# EAGLE design USB Miner (EAGLE 9.6.2)
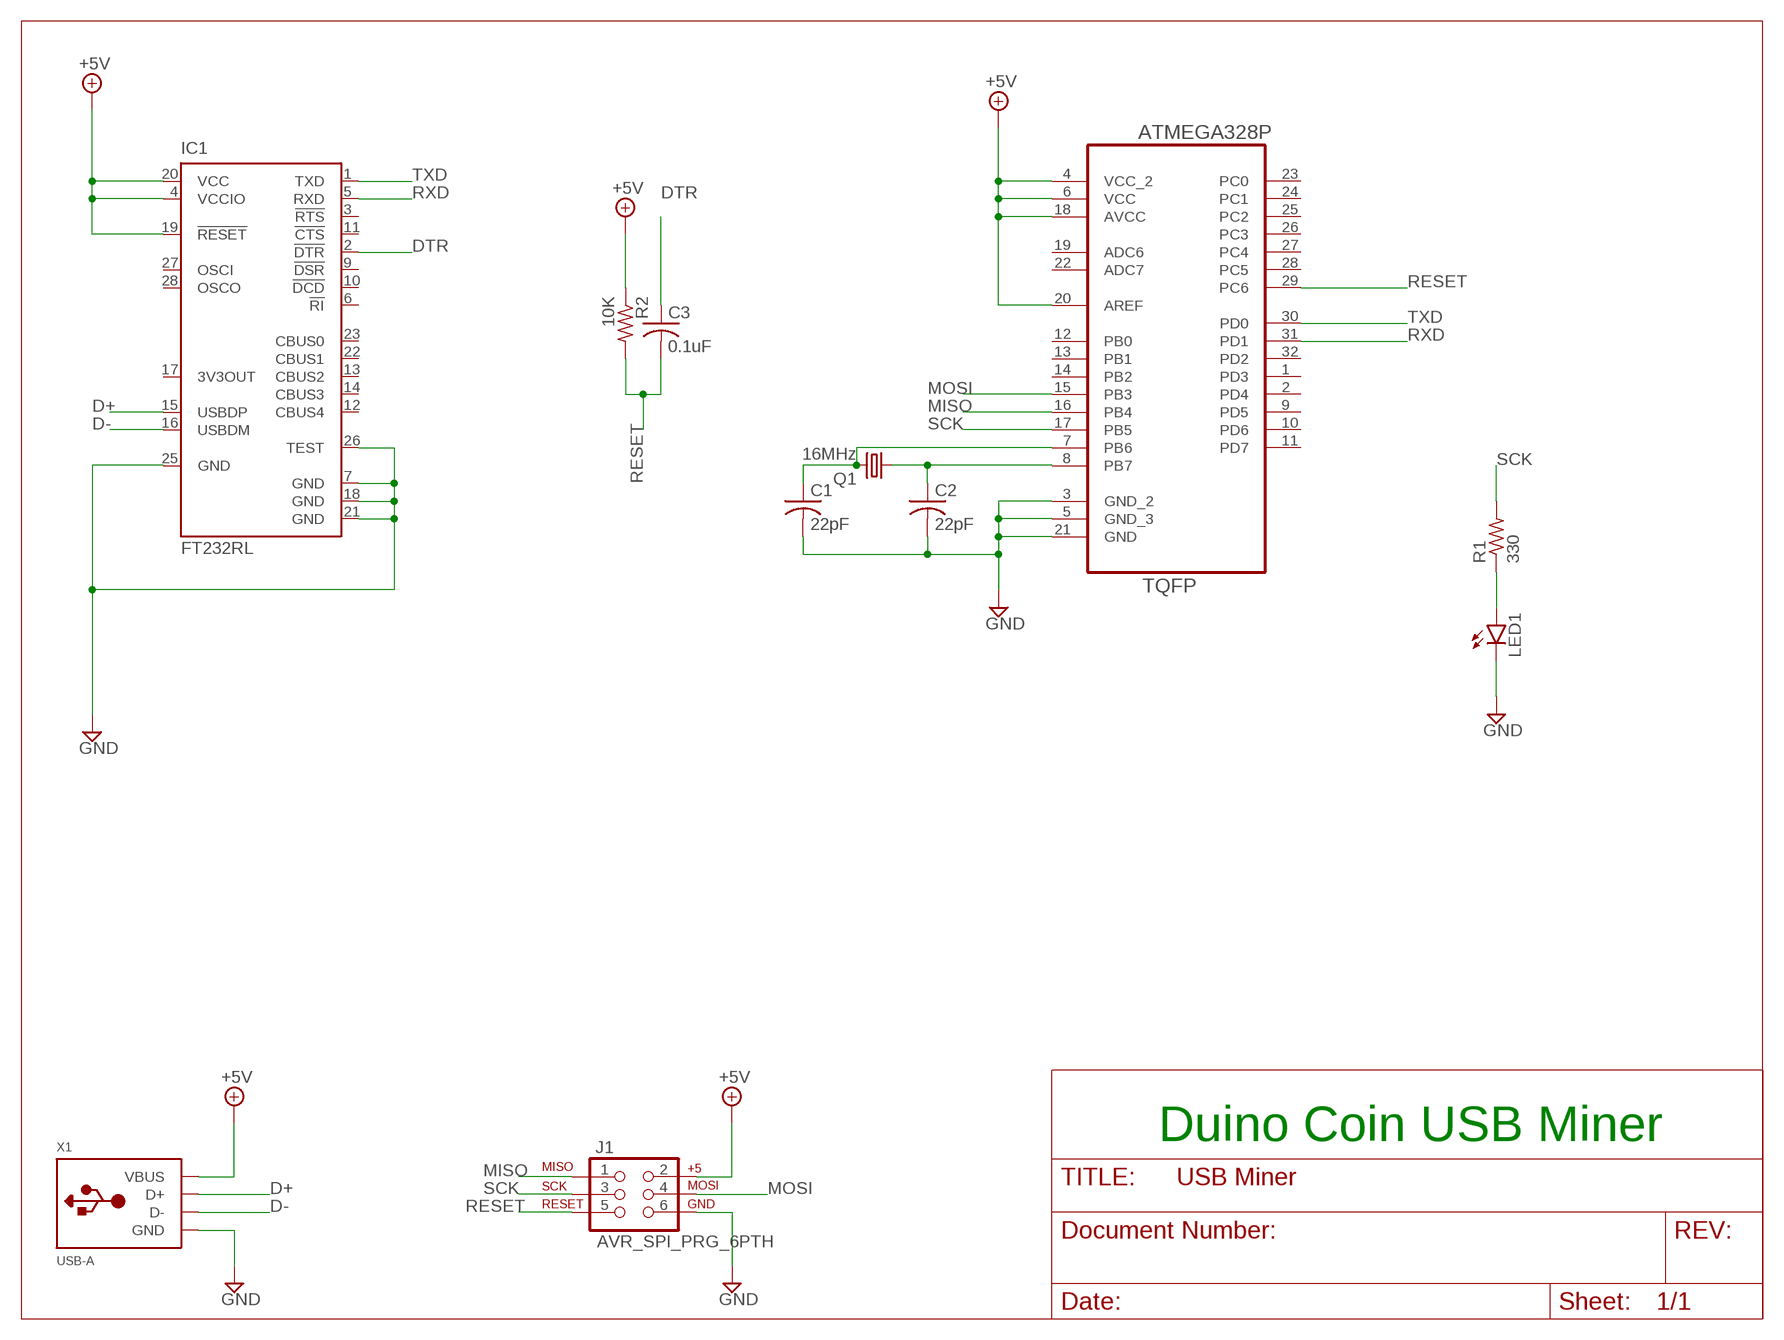
[diagram p0: schematic, sheet 1]

## Parts
C1  22pF  C-USC0805  [C0805]
C2  22pF  C-USC0805  [C0805]
C3  0.1uF  C-USC0805  [C0805]
IC1  FT232RL  [SSOP28]
J1  AVR_SPI_PRG_6PTH  [2X3]
LED1  LEDCHIP-LED0805  [CHIP-LED0805]
Q1  16MHz  CRYSTALCTS406  [CTS406]
R1  330  R-US_M0805  [M0805]
R2  10K  R-US_M0805  [M0805]
U1  ATMEGA328P-AU  [QFP80P900X900X120-32N]
X1  USB-A  [MOLEX_480371000]

## Nets
+5V: IC1.4(VCCIO) IC1.19(!RESET) IC1.20(VCC) J1.2 R2.1 U1.4(VCC_2) U1.6(VCC) U1.18(AVCC) U1.20(AREF) X1.1(VBUS)
D+: IC1.15(USBDP) X1.3(D+)
D-: IC1.16(USBDM) X1.2(D-)
DTR: C3.1 IC1.2(!DTR)
GND: C1.2 C2.2 IC1.7(GND) IC1.18(GND) IC1.21(GND) IC1.25(GND) IC1.26(TEST) J1.6 LED1.C U1.3(GND_2) U1.5(GND_3) U1.21(GND) X1.4(GND)
MISO: J1.1 U1.16(PB4)
MOSI: J1.4 U1.15(PB3)
N$1: C2.1 Q1.1 U1.8(PB7)
N$2: C1.1 Q1.3 U1.7(PB6)
N$3: LED1.A R1.1
RESET: C3.2 J1.5 R2.2 U1.29(PC6)
RXD: IC1.5(RXD) U1.31(PD1)
SCK: J1.3 R1.2 U1.17(PB5)
TXD: IC1.1(TXD) U1.30(PD0)
Unconnected: IC1.3(!RTS) IC1.6(!RI) IC1.9(!DSR) IC1.10(!DCD) IC1.11(!CTS) IC1.12(CBUS4) IC1.13(CBUS2) IC1.14(CBUS3) IC1.17(3V3OUT) IC1.22(CBUS1) IC1.23(CBUS0) IC1.27(OSCI) IC1.28(OSCO) U1.1(PD3) U1.2(PD4) U1.9(PD5) U1.10(PD6) U1.11(PD7) U1.12(PB0) U1.13(PB1) U1.14(PB2) U1.19(ADC6) U1.22(ADC7) U1.23(PC0) U1.24(PC1) U1.25(PC2) U1.26(PC3) U1.27(PC4) U1.28(PC5) U1.32(PD2)

## Notes on the sheet
- Duino Coin USB Miner

## Library data of the parts
C1-C3 = rcl:C-US: CAPACITOR, American symbol; SPICEPREFIX: C
IC1 = ftdichip:FT232R: Source: http://www.ftdichip.com/Documents/DataSheets/DS_FT232R_v104.pdf; MPN: FT232RL; OC_FARNELL: 1146032; OC_NEWARK: 91K9918
J1 = SparkFun:AVR_SPI_PRG_6: AVR ISP 6 Pin This is the reduced ISP connector for AVR programming. Common on Arduino. This footprint will take up less PCB space and can be used with a 10-pin to 6-pin adapter such as SKU: BOB-08508
LED1 = led:LED: LED OSRAM: - CHIPLED LG R971, LG N971, LY N971, LG Q971, LY Q971, LO R971, LY R971 LH N974, LH R974 LS Q976, LO Q976, LY Q976 LO Q996 - Hyper CHIPLED LW Q18S LB Q993, LB Q99A, LB R99A - SideLED LS A670, LO A670, LY A670, LG A670, LP A670 LB A673, LV A673, LT A673, LW A673 LH A674 LY A675 LS A676, LA A676, LO A676, LY A676, LW A676 LS A679, LY A679, LG A679 - Hyper Micro SIDELED® LS Y876, LA Y876, LO Y876, LY Y876 LT Y87S - SmartLED LW L88C, LW L88S LB L89C, LB L89S, LG L890 LS L89K, LO L89K, LY L89K LS L896, LA L896, LO L896, LY L896 - TOPLED LS T670, LO T670, LY T670, LG T670, LP T670 LSG T670, LSP T670, LSY T670, LOP T670, LYG T670 LG T671, LOG T671, LSG T671 LB T673, LV T673, LT T673, LW T673 LH T674 LS T676, LA T676, LO T676, LY T676, LB T676, LH T676, LSB T676, LW T676 LB T67C, LV T67C, LT T67C, LS T67K, LO T67K, LY T67K, LW E67C LS E67B, LA E67B, LO E67B, LY E67B, LB E67C, LV E67C, LT E67C LW T67C LS T679, LY T679, LG T679 LS T770, LO T770, LY T770, LG T770, LP T770 LB T773, LV T773, LT T773, LW T773 LH T774 LS E675, LA E675, LY E675, LS T675 LS T776, LA T776, LO T776, LY T776, LB T776 LHGB T686 LT T68C, LB T68C - Hyper Mini TOPLED® LB M676 - Mini TOPLED Santana® LG M470 LS M47K, LO M47K, LY M47K Source: http://www.osram.convergy.de LUXEON: - LUMILED® LXK2-PW12-R00, LXK2-PW12-S00, LXK2-PW14-U00, LXK2-PW14-V00 LXK2-PM12-R00, LXK2-PM12-S00, LXK2-PM14-U00 LXK2-PE12-Q00, LXK2-PE12-R00, LXK2-PE12-S00, LXK2-PE14-T00, LXK2-PE14-U00 LXK2-PB12-K00, LXK2-PB12-L00, LXK2-PB12-M00, LXK2-PB14-N00, LXK2-PB14-P00, LXK2-PB14-Q00 LXK2-PR12-L00, LXK2-PR12-M00, LXK2-PR14-Q00, LXK2-PR14-R00 LXK2-PD12-Q00, LXK2-PD12-R00, LXK2-PD12-S00 LXK2-PH12-R00, LXK2-PH12-S00 LXK2-PL12-P00, LXK2-PL12-Q00, LXK2-PL12-R00 Source: www.luxeon.com KINGBRIGHT: KA-3528ASYC Source: www.kingbright.com
Q1 = crystal:CRYSTAL: CRYSTAL; OC_FARNELL: unknown; OC_NEWARK: unknown
R1 R2 = rcl:R-US_: RESISTOR, American symbol; SPICEPREFIX: R
U1 = Ava:ATMEGA328P-AU; DESCRIPTION: 8-bit Microcontroller with In-System Programmable Flash; MPN: ATMEGA328P-AU; OC_FARNELL: 1715486; OC_NEWARK: 14R4631; PACKAGE: TQFP-32; SUPPLIER: Atmel
X1 = adafruit:USB-A: USB type A 'plug' Used for things that can directly connect to a USB port, say USB key

## Board
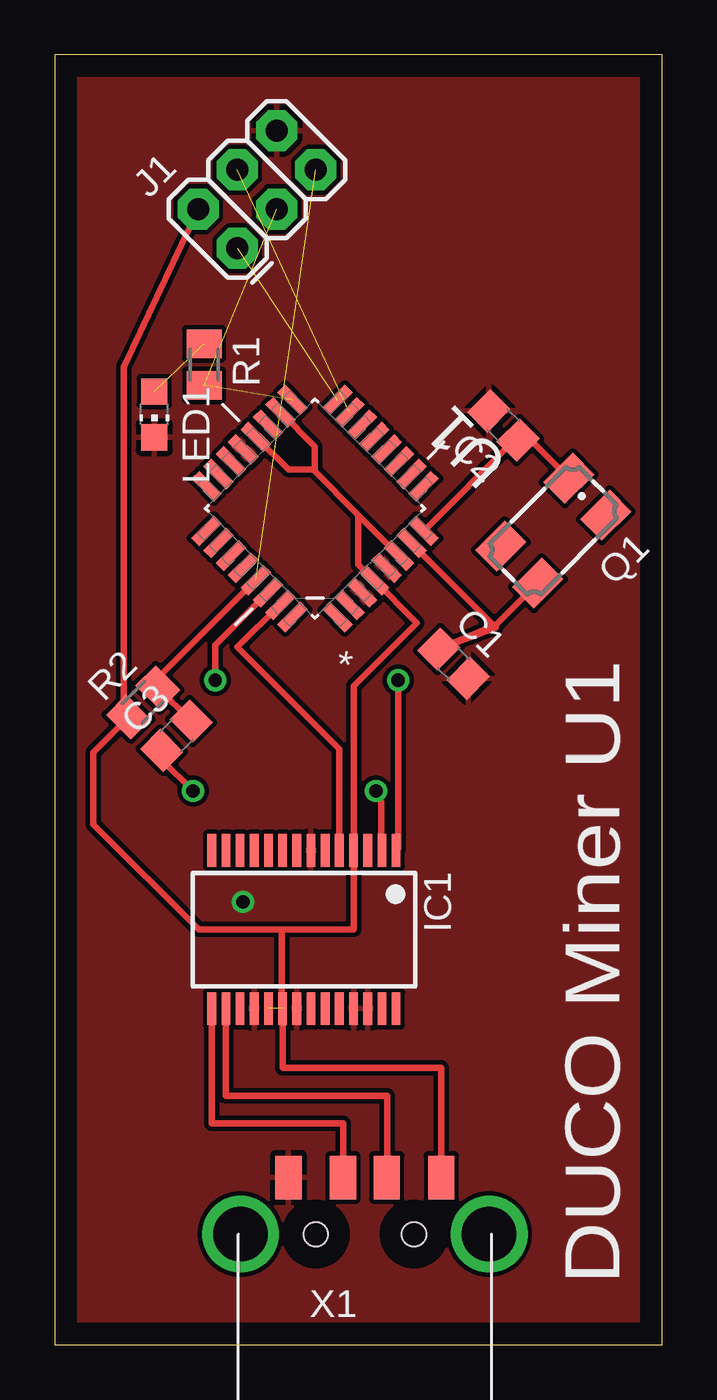
[diagram p1: board, top side]
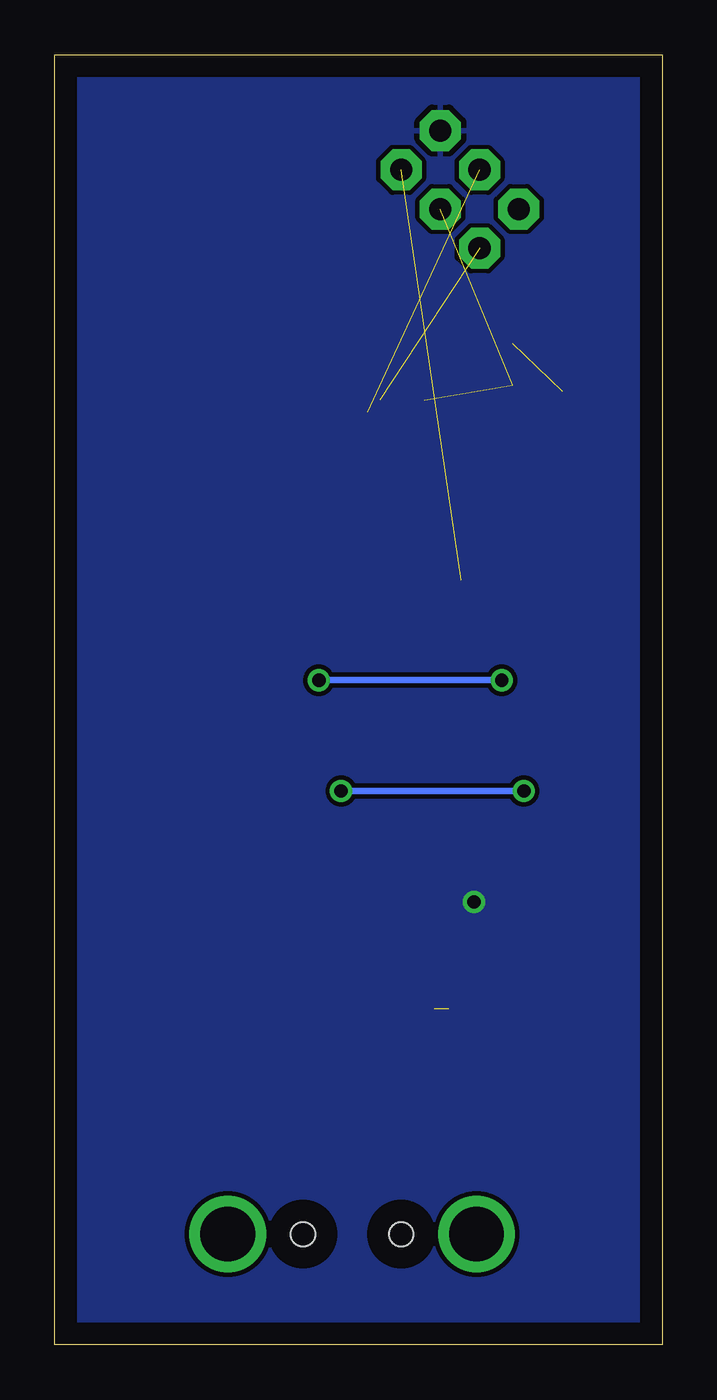
[diagram p2: board, bottom side, seen from below]

Size 27.86 x 59.17 mm. Coordinates in mm from the lower left corner, seen from the top.
Outline: 0,0 27.86,0 27.86,59.17 0,59.17 0,0
Copper layers (1*16): Top 0.035mm / dielectric 1.5mm / Bottom 0.035mm
Design rules "default": minimum track width 10mil, minimum drill 24mil, track to track 8mil, track to pad 8mil, pad to pad 8mil, via to via 8mil, smd to smd 8mil, copper to edge 40mil, drill to drill 8mil, minimum pad ring 10mil, minimum via ring 8mil, stop-mask expansion 4mil, vias tented up to drill 0mil, thermal gap 10mil

### Footprints (pad centres in the part's own frame; a part is rotated, then mirrored left to right if it is on the bottom)
C0805 = smd 1.3 x 1.5: 1 -0.95,0; 2 0.95,0
SSOP28 = smd 0.4 x 1.5: 1 -4.225,-3.625; 2 -3.575,-3.625; 3 -2.925,-3.625; 4 -2.275,-3.625; 5 -1.625,-3.625; 6 -0.975,-3.625; 7 -0.325,-3.625; 8 0.325,-3.625; 9 0.975,-3.625; 10 1.625,-3.625; 11 2.275,-3.625; 12 2.925,-3.625; 13 3.575,-3.625; 14 4.225,-3.625; 15 4.225,3.625; 16 3.575,3.625; 17 2.925,3.625; 18 2.275,3.625; 19 1.625,3.625; 20 0.975,3.625; 21 0.325,3.625; 22 -0.325,3.625; 23 -0.975,3.625; 24 -1.625,3.625; 25 -2.275,3.625; 26 -2.925,3.625; 27 -3.575,3.625; 28 -4.225,3.625
2X3 = drill 1.016 pad 1.88 octagon: 1 0,0; 2 0,2.54; 3 2.54,0; 4 2.54,2.54; 5 5.08,0; 6 5.08,2.54
CHIP-LED0805 = smd 1.2 x 1.2: A 0,-1.05; C 0,1.05
CTS406 = smd 1.9 x 1.4: 1 -2.2,-1.2; 2 2.2,-1.2; 3 2.2,1.2; 4 -2.2,1.2
M0805 = smd 1.3 x 1.6: 1 -0.95,0; 2 0.95,0
QFP80P900X900X120-32N = smd 1.473 x 0.508: 1 -4.242,2.794; 2 -4.242,2.007; 3 -4.242,1.194; 4 -4.242,0.406; 5 -4.242,-0.406; 6 -4.242,-1.194; 7 -4.242,-2.007; 8 -4.242,-2.794; 17 4.242,-2.794; 18 4.242,-2.007; 19 4.242,-1.194; 20 4.242,-0.406; 21 4.242,0.406; 22 4.242,1.194; 23 4.242,2.007; 24 4.242,2.794 | smd 0.508 x 1.473: 9 -2.794,-4.242; 10 -2.007,-4.242; 11 -1.194,-4.242; 12 -0.406,-4.242; 13 0.406,-4.242; 14 1.194,-4.242; 15 2.007,-4.242; 16 2.794,-4.242; 25 2.794,4.242; 26 2.007,4.242; 27 1.194,4.242; 28 0.406,4.242; 29 -0.406,4.242; 30 -1.194,4.242; 31 -2.007,4.242; 32 -2.794,4.242
MOLEX_480371000 = smd 1.2 x 2: 1 3.5,2.6; 2 1,2.6; 3 -1,2.6; 4 -3.5,2.6 | drill 2.5: M1 -5.7,0; M2 5.7,0 | hole 1.1: -2.25,0; 2.25,0

### Placement (x,y rotation side)
C1  18.29,31.24 315 top
C2  20.57,42.16 135 top
C3  5.59,27.94 45 top
IC1  11.43,19.05 180 top
J1  8.38,50.29 45 top
LED1  4.57,42.67 180 top
Q1  22.86,37.34 225 top
R1  6.86,44.96 270 top
R2  4.06,29.46 45 top
U1  11.94,38.35 135 top
X1  14.22,5.08 0 top

### Tracks (layer width: path | path; a pad name or v marks a point on that pad's centre or on a via)
+5V  (1 unrouted)
  Top 0.305: X1.1 17.72,12.7 10.46,12.7 IC1.20 10.41,15.43 10.41,19.05 | 10.41,19.05 13.72,19.05 IC1.4 13.71,30.21 16.6,33.11 U1.4 13.93,35.79 13.93,38.05 | U1.20 10.73,40.13 11.85,40.13 | U1.18 11.94,41.19 11.94,40.13 11.85,40.13 | U1.6 13.93,38.05 | 13.93,38.05 11.85,40.13 | R2.1 3.17,28.57 | 3.17,28.57 1.78,27.18 1.78,23.88 6.6,19.05 10.41,19.05 | J1.2 3.17,44.84 3.17,28.57
D+
  Top 0.305: IC1.15 7.21,10.16 13.22,10.16 X1.3
D-
  Top 0.305: IC1.16 7.86,11.43 15.24,11.43 15.24,7.7 X1.2
DTR  (via drill 0.61)
  Top 0.305: IC1.2 14.99,22.69 14.99,24.89 v14.73,25.4 | v6.35,25.4 4.92,26.83 C3.1
  Bottom 0.305: v14.73,25.4 v6.35,25.4
GND  (via drill 0.61)
  other vias: 8.64,20.32
  pour Top: 0,0 27.94,0 27.94,59.18 0,59.18
  pour Bottom: 0,0 27.94,0 27.94,59.18 0,59.18
MISO  (1 unrouted)
MOSI  (1 unrouted)
N$1
  Top 0.305: U1.8 21.07,41.49 C2.1 21.82,41.49 Q1.1
N$2
  Top 0.305: U1.7 20.23,32.9 C1.1 20.23,33.01 Q1.3
N$3  (1 unrouted)
RESET  (1 unrouted)
  Top 0.305: U1.29 4.74,30.58 R2.2 C3.2
RXD
  Top 0.305: IC1.5 13.05,27.33 8.38,32 10.31,33.94 U1.31
SCK  (2 unrouted)
TXD  (via drill 0.61)
  Top 0.305: U1.30 7.37,32.09 v7.37,30.48 | v15.75,30.48 15.75,22.77 IC1.1
  Bottom 0.305: v15.75,30.48 v7.37,30.48

### Text on the board
tNames: DUCO Miner U1